# EAGLE design sd card breakout (EAGLE 9.4.2)
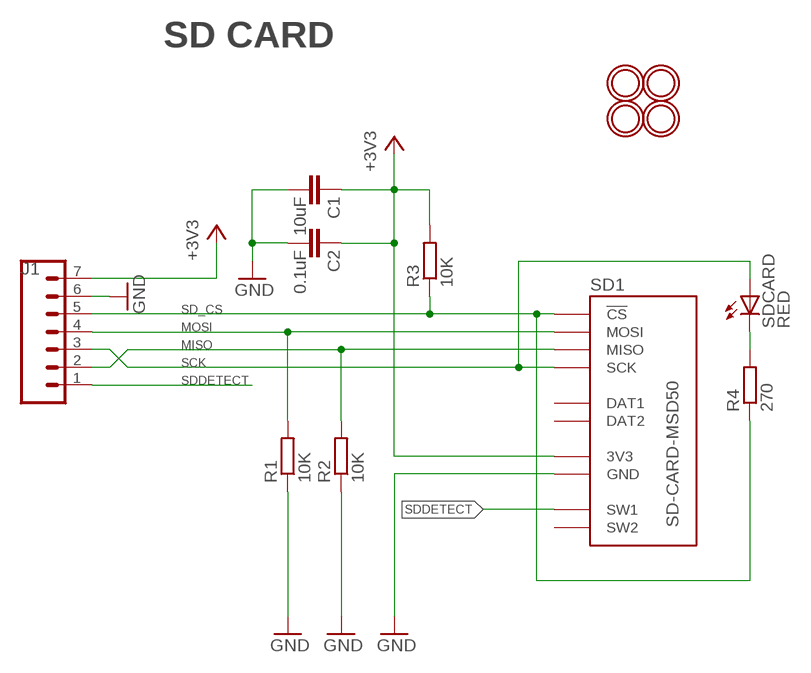
[diagram p0: schematic, sheet 1]

## Parts
C1  10uF  C-EUC0805K  [C0805K]
C2  0.1uF  C-EUC0805K  [C0805K]
J1  CONN_07NO_SILK  [1X07_NO_SILK]
MH1  MOUNTINGHOLE2.5  [MOUNTINGHOLE_2.5_PLATED]
MH2  MOUNTINGHOLE2.5  [MOUNTINGHOLE_2.5_PLATED]
MH3  MOUNTINGHOLE2.5  [MOUNTINGHOLE_2.5_PLATED]
MH4  MOUNTINGHOLE2.5  [MOUNTINGHOLE_2.5_PLATED]
R1  10K  R-EU_R0805  [R0805]
R2  10K  R-EU_R0805  [R0805]
R3  10K  R-EU_R0805  [R0805]
R4  270  R-EU_R0805  [R0805]
SD1  SD-CARD-MSD50  [SD_5031821853]
SDCARD  RED  LEDCHIP-LED0805  [CHIP-LED0805]

## Nets
+3V3 [power1]: C1.1 C2.1 J1.7 R3.2 SD1.VCC(3V3)
GND [power1]: C1.2 C2.2 J1.6 R1.1 R2.1 SD1.GND
MISO: J1.2 R2.2 SD1.MISO
MOSI: J1.4 R1.2 SD1.MOSI
N$27: R4.2 SDCARD.C
SCK: J1.3 SD1.SCK SDCARD.A
SD_CS: J1.5 R3.1 R4.1 SD1.CS(!CS)
SDDETECT: J1.1 SD1.SW1
Unconnected: SD1.DAT1 SD1.DAT2 SD1.SW2

## Notes on the sheet
- SD CARD

## Library data of the parts
C1 C2 = rcl:C-EU: CAPACITOR, European symbol; SPICEPREFIX: C
J1 = SparkFun-Connectors:CONN_07: Multi connection point. Often used as Generic Header-pin footprint for 0.1 inch spaced/style header connections On any of the 0.1 inch spaced packages, you can populate with these: Break Away Headers - Straight <https://www.sparkfun.com/products/116> (PRT-00116) Break Away Male Headers - Right Angle <https://www.sparkfun.com/products/553> (PRT-00553) Female Headers <https://www.sparkfun.com/products/115> (PRT-00115) Break Away Headers - Machine Pin <https://www.sparkfun.com/products/117> (PRT-00117) Break Away Female Headers - Swiss Machine Pin <https://www.sparkfun.com/products/743> (PRT-00743) For SCREWTERMINALS and SPRING TERMINALS visit here: Screw Terimnals on SparkFun.com <https://www.sparkfun.com/search/results?term=Screw+Terminals> (5mm/3.5mm/2.54mm spacing) This device is also useful as a general connection point to wire up your design to another part of your project. Our various solder wires solder well into these plated through hole pads. Hook-Up Wire - Assortment (Stranded, 22 AWG) <https://www.sparkfun.com/products/11375> (PRT-11375) Hook-Up Wire - Assortment (Solid Core, 22 AWG) <https://www.sparkfun.com/products/11367> (PRT-11367) View the entire wire category on our website here <https://www.sparkfun.com/categories/141> Special notes: Molex polarized connector foot print use with SKU : PRT-08231 with associated crimp pins and housings. 1MM SMD Version SKU: PRT-10208 NOTES ON THE VARIANTS LOCK and LOCK_LONGPADS... This footprint was designed to help hold the alignment of a through-hole component (i.e. 6-pin header) while soldering it into place. You may notice that each hole has been shifted either up or down by 0.005 of an inch from it's more standard position (which is a perfectly straight line). This slight alteration caused the pins (the squares in the middle) to touch the edges of the holes. Because they are alternating, it causes a "brace" to hold the component in place. 0.005 has proven to be the perfect amount of "off-center" position when using our standard breakaway headers. Although looks a little odd when you look at the bare footprint, once you have a header in there, the alteration is very hard to notice. Also,if you push a header all the way into place, it is covered up entirely on the bottom side.
MH1-MH4 = microbuilder:MOUNTINGHOLE: Mounting Hole For #2 screws (0.086"/2.18mm width, 0.094"/2.4mm hole) use 2.5mm
R1-R4 = rcl:R-EU_: RESISTOR, European symbol; SPICEPREFIX: R
SD1 = we-con:SD-CARD: SD-Card Sockets; DIGIKEY: WM9750TR-ND
SDCARD = led:LED: LED OSRAM: - CHIPLED LG R971, LG N971, LY N971, LG Q971, LY Q971, LO R971, LY R971 LH N974, LH R974 LS Q976, LO Q976, LY Q976 LO Q996 - Hyper CHIPLED LW Q18S LB Q993, LB Q99A, LB R99A - SideLED LS A670, LO A670, LY A670, LG A670, LP A670 LB A673, LV A673, LT A673, LW A673 LH A674 LY A675 LS A676, LA A676, LO A676, LY A676, LW A676 LS A679, LY A679, LG A679 - Hyper Micro SIDELED® LS Y876, LA Y876, LO Y876, LY Y876 LT Y87S - SmartLED LW L88C, LW L88S LB L89C, LB L89S, LG L890 LS L89K, LO L89K, LY L89K LS L896, LA L896, LO L896, LY L896 - TOPLED LS T670, LO T670, LY T670, LG T670, LP T670 LSG T670, LSP T670, LSY T670, LOP T670, LYG T670 LG T671, LOG T671, LSG T671 LB T673, LV T673, LT T673, LW T673 LH T674 LS T676, LA T676, LO T676, LY T676, LB T676, LH T676, LSB T676, LW T676 LB T67C, LV T67C, LT T67C, LS T67K, LO T67K, LY T67K, LW E67C LS E67B, LA E67B, LO E67B, LY E67B, LB E67C, LV E67C, LT E67C LW T67C LS T679, LY T679, LG T679 LS T770, LO T770, LY T770, LG T770, LP T770 LB T773, LV T773, LT T773, LW T773 LH T774 LS E675, LA E675, LY E675, LS T675 LS T776, LA T776, LO T776, LY T776, LB T776 LHGB T686 LT T68C, LB T68C - Hyper Mini TOPLED® LB M676 - Mini TOPLED Santana® LG M470 LS M47K, LO M47K, LY M47K Source: http://www.osram.convergy.de LUXEON: - LUMILED® LXK2-PW12-R00, LXK2-PW12-S00, LXK2-PW14-U00, LXK2-PW14-V00 LXK2-PM12-R00, LXK2-PM12-S00, LXK2-PM14-U00 LXK2-PE12-Q00, LXK2-PE12-R00, LXK2-PE12-S00, LXK2-PE14-T00, LXK2-PE14-U00 LXK2-PB12-K00, LXK2-PB12-L00, LXK2-PB12-M00, LXK2-PB14-N00, LXK2-PB14-P00, LXK2-PB14-Q00 LXK2-PR12-L00, LXK2-PR12-M00, LXK2-PR14-Q00, LXK2-PR14-R00 LXK2-PD12-Q00, LXK2-PD12-R00, LXK2-PD12-S00 LXK2-PH12-R00, LXK2-PH12-S00 LXK2-PL12-P00, LXK2-PL12-Q00, LXK2-PL12-R00 Source: www.luxeon.com KINGBRIGHT: KA-3528ASYC Source: www.kingbright.com

## Net classes
0 default: width 0.152 mm
1 power1: width 0.254 mm

## Board
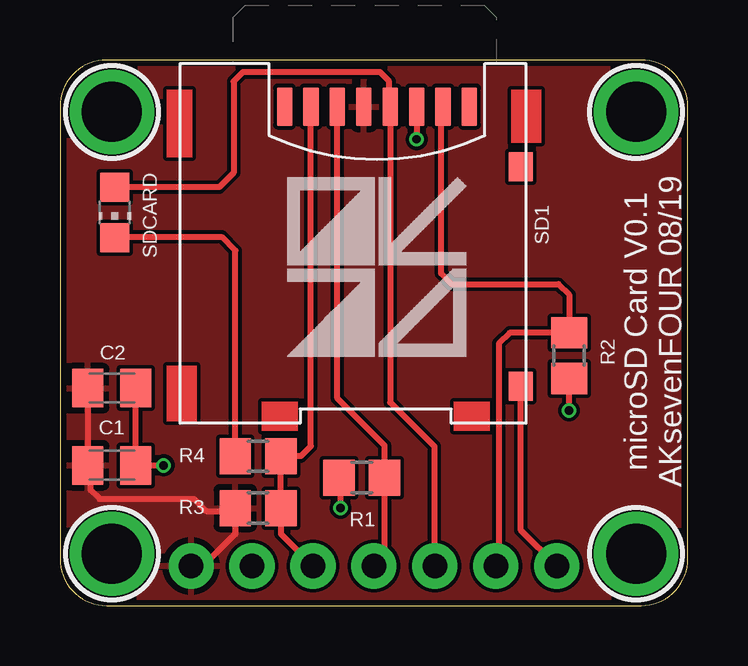
[diagram p1: board, top side]
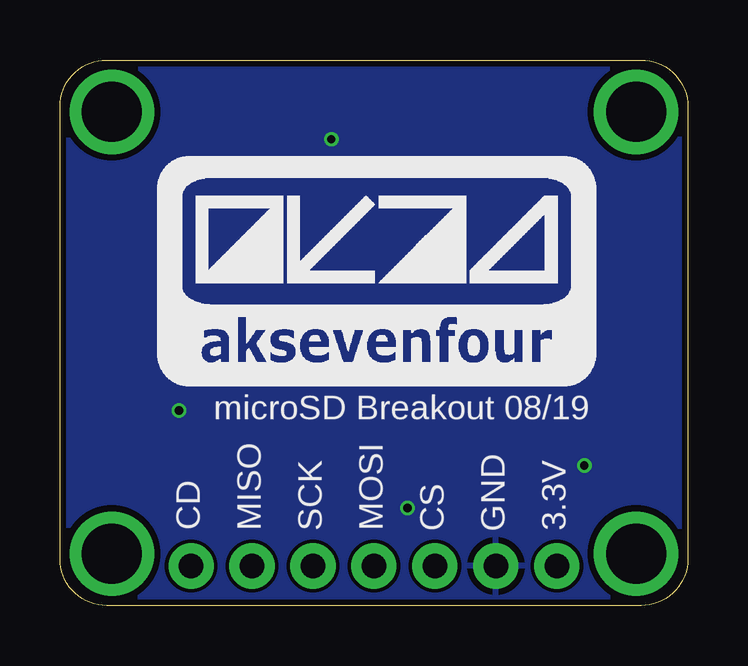
[diagram p2: board, bottom side, seen from below]

Size 26.16 x 22.73 mm. Coordinates in mm from the lower left corner, seen from the top.
Outline: 24.22,22.73 1.95,22.73 arc90 0,20.79 0,1.95 arc90 1.95,0 24.22,0 arc90 26.16,1.95 26.16,20.79 arc90 24.22,22.73
Copper layers (1*16): Top 0.07mm / dielectric 1.5mm / Bottom 0.07mm
Design rules "jlcpcb-2layer *": minimum track width 5mil, minimum drill 0.2mm, track to track 6mil, track to pad 6mil, pad to pad 6mil, via to via 6mil, smd to smd 6mil, copper to edge 10mil, drill to drill 5mil, minimum pad ring 10mil, minimum via ring 5mil, stop-mask expansion 2mil, vias tented up to drill 20mil, thermal gap 10mil

### Footprints (pad centres in the part's own frame; a part is rotated, then mirrored left to right if it is on the bottom)
C0805K = smd 1.3 x 1.6: 1 -1,0; 2 1,0
1X07_NO_SILK = drill 1.016 pad 1.88: 1 0,0; 2 2.54,0; 3 5.08,0; 4 7.62,0; 5 10.16,0; 6 12.7,0; 7 15.24,0
MOUNTINGHOLE_2.5_PLATED = drill 2.5 pad 3.2: P$1 0,0
R0805 = smd 1.3 x 1.5: 1 -0.95,0; 2 0.95,0
SD_5031821853 = smd 0.65 x 1.6: CS 2.75,0.8; DAT1 -3.85,0.8; DAT2 3.85,0.8; GND -1.65,0.8; MISO -2.75,0.8; MOSI 1.65,0.8; SCK -0.55,0.8; VCC 0.55,0.8 | smd 1 x 1.2: SW1 -6,12.45; SW2 -6,3.3
CHIP-LED0805 = smd 1.2 x 1.2: A 0,-1.05; C 0,1.05

### Placement (x,y rotation side)
C1  2.16,5.84 0 top
C2  2.16,9.06 0 top
J1  20.7,1.65 180 top
MH1  24,2.16 180 top
MH2  24,20.57 180 top
MH3  2.16,2.16 180 top
MH4  2.16,20.57 180 top
R1  12.57,5.33 0 top
R2  21.21,10.41 90 top
R3  8.26,4.06 180 top
R4  8.26,6.22 180 top
SD1  13.21,21.59 180 top
SDCARD  2.29,16.38 180 top
U$1  [AK74_LOGO_MEDIUM]  13.21,15.49 0 bottom
U$2  [AK74_LOGO_MEDIUM_TEXTONLY_SQUARE]  16.76,16.26 0 top

### Tracks (layer width: path | path; a pad name or v marks a point on that pad's centre or on a via)
+3V3
  Top 0.254: R3.2 7.3,3.94 | 7.3,3.94 7.3,2.99 5.97,1.65 J1.7 | C2.1 C1.1 1.27,5.73 1.27,4.83 1.65,4.45 5.59,4.45 6.1,3.94 7.3,3.94
  pour Top: 26.92,-0.64 26.92,23.5 -0.76,23.5 -0.76,-0.64
GND  (via drill 0.35)
  Top 0.254: SD1.GND v14.86,19.43 | R1.1 11.68,5.27 v11.68,4.06 | v4.32,5.84 4.19,5.84 4.17,5.83 3.17,5.83 C1.2 C2.2 | v21.21,8.13 R2.1
  pour Bottom: 27.62,-1.33 27.62,24.13 -1.4,24.13 -1.4,-1.33
MISO
  Top 0.254: SD1.MISO 15.88,20.71 15.88,13.84 16.32,13.4 20.77,13.4 21.21,12.95 R2.2 18.73,11.36 18.29,10.92 18.29,1.78 J1.2
MOSI
  Top 0.254: SD1.MOSI 11.56,8.63 13.52,6.67 R1.2 13.52,2.09 J1.4
N$27
  Top 0.254: R4.2 7.3,14.79 6.73,15.37 2.32,15.37 SDCARD.C
SCK
  Top 0.254: SDCARD.A 6.64,17.43 7.24,18.03 7.24,21.84 7.62,22.23 13.34,22.23 13.72,21.84 13.72,20.83 SD1.SCK 13.76,8.47 15.6,6.63 15.6,1.68 J1.3
SD_CS
  Top 0.254: J1.5 9.21,2.99 R3.1 R4.1 10.03,6.22 10.46,6.65 SD1.CS
SDDETECT
  Top 0.254: J1.1 19.21,3.14 SD1.SW1

### Text on the board
tPlace: microSD Card V0.1 / AKsevenFOUR 08/19
bPlace: microSD Breakout 08/19 | 3.3V | GND | MOSI | SCK | MISO | CS | CD